# EAGLE schematic schematicEagle (EAGLE 9.6.2)
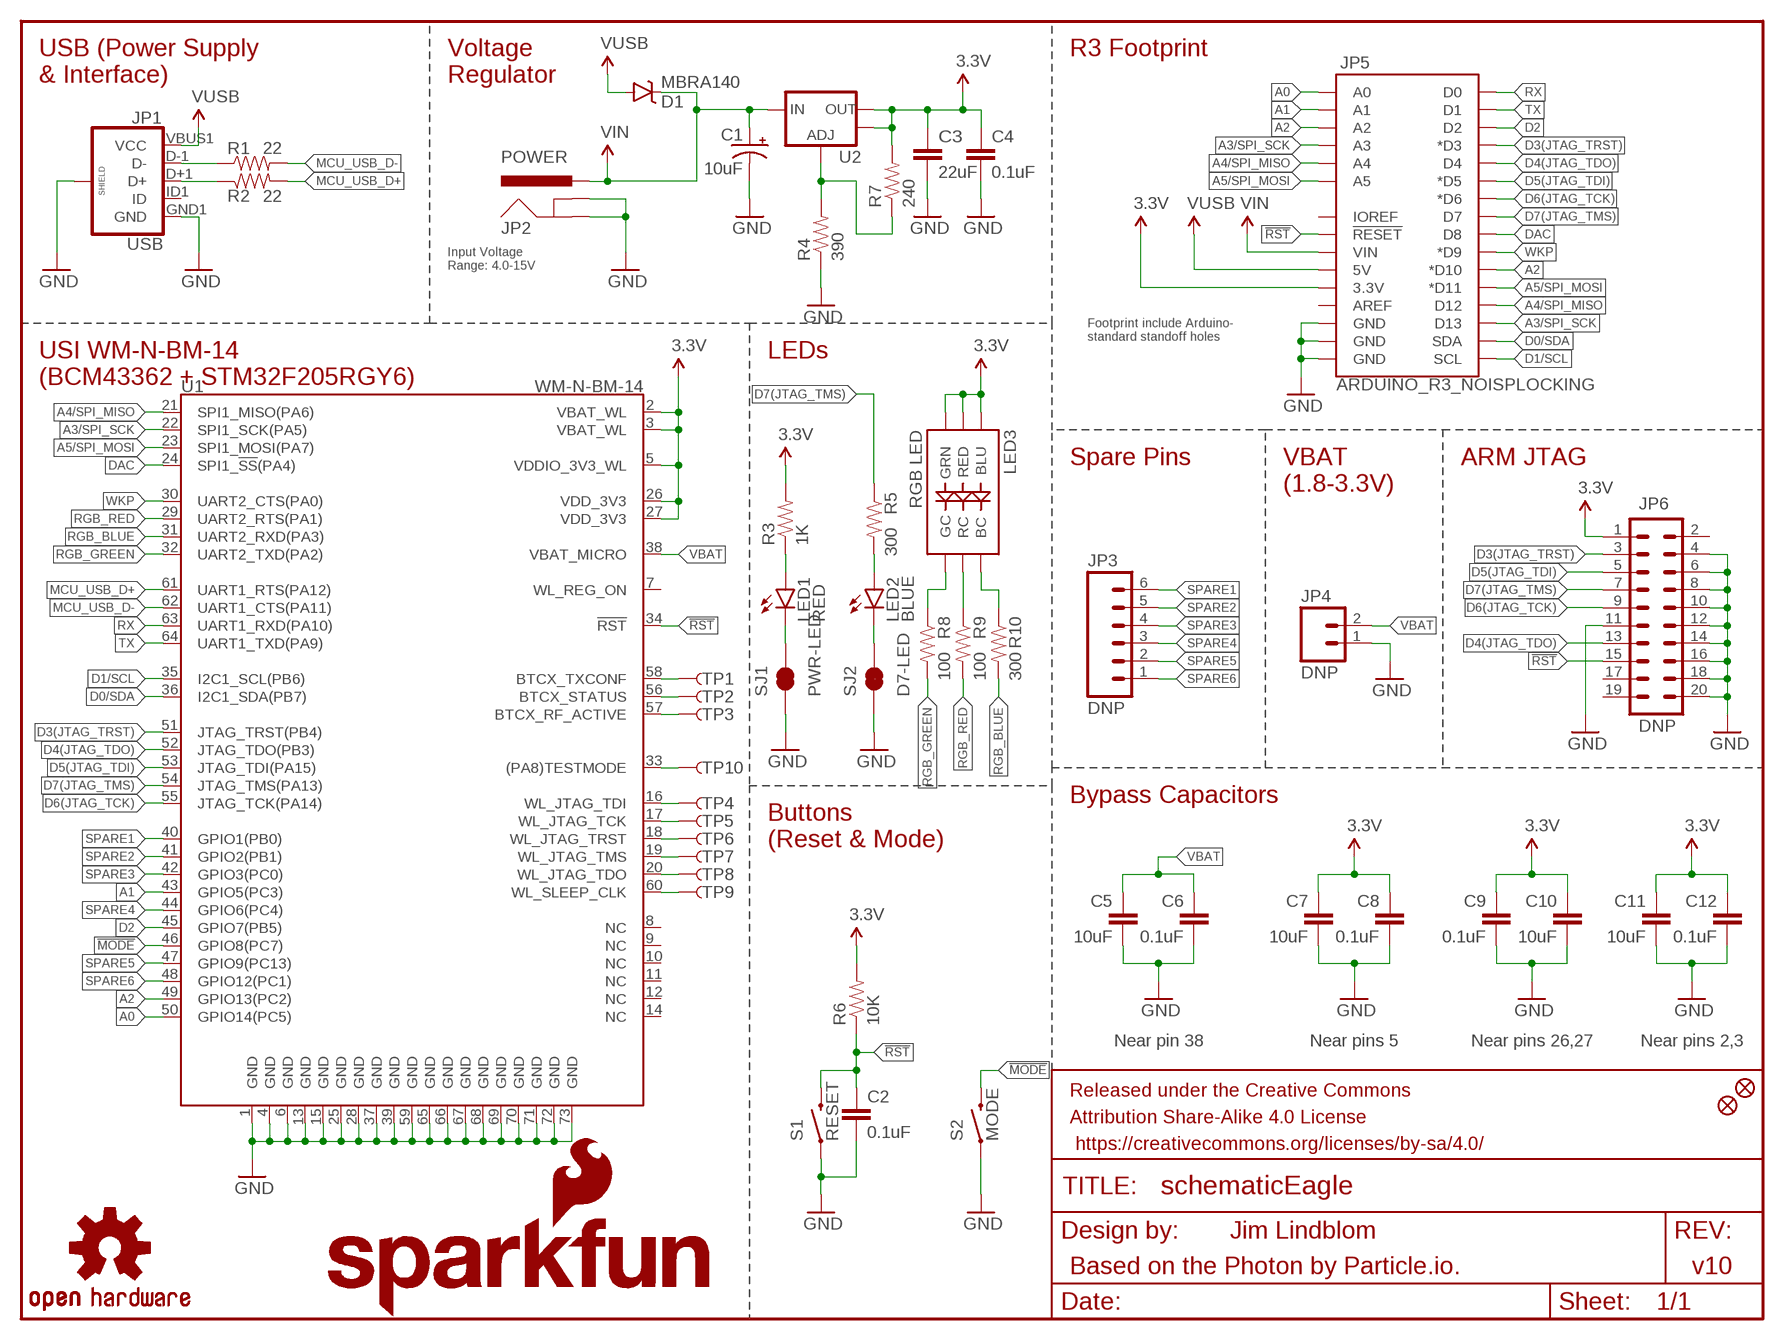
[diagram p0: schematic, sheet 1]

## Parts
C1  10uF  10UF-16V-10%(TANT)  [EIA3216]
C2  0.1uF  0.1UF-25V(+80/-20%)(0603)  [0603-CAP]
C3  22uF  22UF-6.3V-20%(0805)  [0805]
C4  0.1uF  0.1UF-25V(+80/-20%)(0603)  [0603-CAP]
C5  10uF  10UF-6.3V-20%(0603)  [0603-CAP]
C6  0.1uF  0.1UF-25V(+80/-20%)(0603)  [0603-CAP]
C7  10uF  10UF-6.3V-20%(0603)  [0603-CAP]
C8  0.1uF  0.1UF-25V(+80/-20%)(0603)  [0603-CAP]
C9  0.1uF  0.1UF-25V(+80/-20%)(0603)  [0603-CAP]
C10  10uF  10UF-6.3V-20%(0603)  [0603-CAP]
C11  10uF  10UF-6.3V-20%(0603)  [0603-CAP]
C12  0.1uF  0.1UF-25V(+80/-20%)(0603)  [0603-CAP]
D1  MBRA140  DIODE-SCHOTTKY-MBRA140  [SMA-DIODE]
FID1  FIDUCIAL1X2  [FIDUCIAL-1X2]
FID2  FIDUCIAL1X2  [FIDUCIAL-1X2]
FRAME1  FRAME-LETTER  [CREATIVE_COMMONS]
JP1  USB  USB_MICROB_PLUGCONN-11752  [USB-B-MICRO-SMD_V03]
JP2  POWER  POWER_JACKPTH_LOCK  [POWER_JACK_PTH_LOCK]
JP3  DNP  M06SILK_FEMALE_PTH  [1X06]
JP4  DNP  M02PTH  [1X02]
JP5  ARDUINO_R3_NOISPLOCKING  [ARDUINO_R3_NOISP_LOCKING]
JP6  DNP  M10X2  [2X10]
LED1  RED  LED-RED1206  [LED-1206]
LED2  BLUE  LED-BLUE1206  [LED-1206]
LED3  RGB LED  LED-TRICOLOR-NO-COMPLCC-6-SMD  [PLCC-6-LED]
LOGO1  OSHW-LOGOM  [OSHW-LOGO-M]
LOGO2  SFE_LOGO_NAME_FLAME.2_INCH  [SFE_LOGO_NAME_FLAME_.2]
LOGO3  SFE_LOGO_NAME_FLAME.4_INCH  [SFE_LOGO_NAME_FLAME_.4]
R1  22  22OHM1/10W1%(0603)  [0603-RES]
R2  22  22OHM1/10W1%(0603)  [0603-RES]
R3  1K  1KOHM-1/10W-1%(0603)  [0603-RES]
R4  390  390OHM1/10W1%(0603)  [0603-RES]
R5  300  300OHM-1/10W-1%(0603)  [0603-RES]
R6  10K  10KOHM-1/10W-1%(0603)0603  [0603-RES]
R7  240  240OHM1/10W1%(0603)  [0603-RES]
R8  100  100OHM-1/10W-1%(0603)  [0603-RES]
R9  100  100OHM-1/10W-1%(0603)  [0603-RES]
R10  300  300OHM-1/10W-1%(0603)  [0603-RES]
S1  RESET  SWITCH-MOMENTARY-2PTH  [TACTILE-PTH]
S2  MODE  SWITCH-MOMENTARY-2PTH  [TACTILE-PTH]
SJ1  PWR-LED  JUMPER-PAD-2-NC_BY_TRACE  [PAD-JUMPER-2-NC_BY_TRACE_YES_SILK]
SJ2  D7-LED  JUMPER-PAD-2-NC_BY_TRACE  [PAD-JUMPER-2-NC_BY_TRACE_YES_SILK]
TP1  TEST-POINTTP_15TH_THRU  [TP_15TH]
TP2  TEST-POINTTP_15TH_THRU  [TP_15TH]
TP3  TEST-POINTTP_15TH_THRU  [TP_15TH]
TP4  TEST-POINTTP_15TH_THRU  [TP_15TH]
TP5  TEST-POINTTP_15TH_THRU  [TP_15TH]
TP6  TEST-POINTTP_15TH_THRU  [TP_15TH]
TP7  TEST-POINTTP_15TH_THRU  [TP_15TH]
TP8  TEST-POINTTP_15TH_THRU  [TP_15TH]
TP9  TEST-POINTTP_15TH_THRU  [TP_15TH]
TP10  TEST-POINTTP_15TH_THRU  [TP_15TH]
U1  WM-N-BM-14  [WM-N-BM-14]
U2  V_REG_LM1117SOT223  [SOT223]

## Nets
3.3V: C3.1 C4.1 C7.1 C8.1 C9.1 C10.1 C11.1 C12.1 JP5.3.3V JP6.1 LED3.AB(BLU) LED3.AG(GRN) LED3.AR(RED) R3.2 R6.2 R7.2 U1.2(VBAT_WL) U1.3(VBAT_WL) U1.5(VDDIO_3V3_WL) U1.26(VDD_3V3) U1.27(VDD_3V3) U2.2(OUT) U2.4(OUT)
!MODE: S2.3 U1.46(GPIO8(PC7))
!RST: C2.1 JP5.RESET@1(!RESET!) JP6.15 R6.1 S1.3 U1.34(!RST!)
A0: JP5.A0 U1.50(GPIO14(PC5))
A1: JP5.A1 U1.43(GPIO5(PC3))
A2: JP5.A2 JP5.D10(*D10) U1.49(GPIO13(PC2))
A3/SPI_SCK: JP5.A3 JP5.D13 U1.22(SPI1_SCK(PA5))
A4/SPI_MISO: JP5.A4 JP5.D12 U1.21(SPI1_MISO(PA6))
A5/SPI_MOSI: JP5.A5 JP5.D11(*D11) U1.23(SPI1_MOSI(PA7))
BTCX_RF_ACTIVE: TP3.P$1 U1.57(BTCX_RF_ACTIVE)
BTCX_STATUS: TP2.P$1 U1.56(BTCX_STATUS)
BTCX_TXCONF: TP1.P$1 U1.58(BTCX_TXCONF)
D0/SDA: JP5.SDA U1.36(I2C1_SDA(PB7))
D1/SCL: JP5.SCL U1.35(I2C1_SCL(PB6))
D2: JP5.D2 U1.45(GPIO7(PB5))
D3(JTAG_TRST): JP5.D3(*D3) JP6.3 U1.51(JTAG_TRST(PB4))
D4(JTAG_TDO): JP5.D4 JP6.13 U1.52(JTAG_TDO(PB3))
D5(JTAG_TDI): JP5.D5(*D5) JP6.5 U1.53(JTAG_TDI(PA15))
D6(JTAG_TCK): JP5.D6(*D6) JP6.9 U1.55(JTAG_TCK(PA14))
D7(JTAG_TMS): JP5.D7 JP6.7 R5.1 U1.54(JTAG_TMS(PA13))
D+: JP1.D+1(D+) R2.1
D-: JP1.D-1(D-) R1.1
DAC: JP5.D8 U1.24(SPI1_!SS!(PA4))
GND: C1.C(-) C2.2 C3.2 C4.2 C5.2 C6.2 C7.2 C8.2 C9.2 C10.2 C11.2 C12.2 JP1.GND1(GND) JP1.SHIELD1(SHIELD) JP1.SHIELD2(SHIELD) JP1.SHIELD3(SHIELD) JP2.GND JP2.GNDBREAK JP4.1 JP5.GND@1(GND) JP5.GND@2(GND) JP5.GND@3(GND) JP6.4 JP6.6 JP6.8 JP6.10 JP6.11 JP6.12 JP6.14 JP6.16 JP6.18 JP6.20 R4.1 S1.1 S2.1 SJ1.1 SJ2.1 U1.1(GND) U1.4(GND) U1.6(GND) U1.13(GND) U1.15(GND) U1.25(GND) U1.28(GND) U1.37(GND) U1.39(GND) U1.59(GND) U1.65(GND) U1.66(GND) U1.67(GND) U1.68(GND) U1.69(GND) U1.70(GND) U1.71(GND) U1.72(GND) U1.73(GND)
MCU_USB_D+: R2.2 U1.61(UART1_RTS(PA12))
MCU_USB_D-: R1.2 U1.62(UART1_CTS(PA11))
N$1: TP10.P$1 U1.33((PA8)TESTMODE)
N$2: LED1.C SJ1.2
N$3: LED3.CG(GC) R8.1
N$4: LED3.CR(RC) R9.1
N$5: LED3.CB(BC) R10.1
N$6: LED1.A R3.1
N$7: LED2.A R5.2
N$8: LED2.C SJ2.2
N$15: R4.2 R7.1 U2.1(ADJ)
RGB_BLUE: R10.2 U1.31(UART2_RXD(PA3))
RGB_GREEN: R8.2 U1.32(UART2_TXD(PA2))
RGB_RED: R9.2 U1.29(UART2_RTS(PA1))
RX: JP5.D0 U1.63(UART1_RXD(PA10))
SPARE1: JP3.6 U1.40(GPIO1(PB0))
SPARE2: JP3.5 U1.41(GPIO2(PB1))
SPARE3: JP3.4 U1.42(GPIO3(PC0))
SPARE4: JP3.3 U1.44(GPIO6(PC4))
SPARE5: JP3.2 U1.47(GPIO9(PC13))
SPARE6: JP3.1 U1.48(GPIO12(PC1))
TX: JP5.D1 U1.64(UART1_TXD(PA9))
VBAT: C5.1 C6.1 JP4.2 U1.38(VBAT_MICRO)
VIN: C1.A(+) D1.C JP2.PWR JP5.VIN U2.3(IN)
VUSB: D1.A JP1.VBUS1(VCC) JP5.5V
WKP: JP5.D9(*D9) U1.30(UART2_CTS(PA0))
WL_JTAG_TCK: TP5.P$1 U1.17(WL_JTAG_TCK)
WL_JTAG_TDI: TP4.P$1 U1.16(WL_JTAG_TDI)
WL_JTAG_TDO: TP8.P$1 U1.20(WL_JTAG_TDO)
WL_JTAG_TMS: TP7.P$1 U1.19(WL_JTAG_TMS)
WL_JTAG_TRST: TP6.P$1 U1.18(WL_JTAG_TRST)
WL_SLEEP_CLK: TP9.P$1 U1.60(WL_SLEEP_CLK)
Unconnected: JP1.ID1(ID) JP5.AREF JP5.IOREF JP6.2 JP6.17 JP6.19 U1.7(WL_REG_ON) U1.8(NC) U1.9(NC) U1.10(NC) U1.11(NC) U1.12(NC) U1.14(NC)

## Notes on the sheet
- USB (Power Supply
  & Interface)
- Voltage
  Regulator
- R3 Footprint
- Input Voltage
  Range: 4.0-15V
- USI WM-N-BM-14
  (BCM43362 + STM32F205RGY6)
- LEDs
- Footprint include Arduino-
  standard standoff holes
- Spare Pins
- VBAT
  (1.8-3.3V)
- ARM JTAG
- Bypass Capacitors
- Buttons
  (Reset & Mode)
- Near pin 38 | Near pins 5 | Near pins 26,27 | Near pins 2,3
- Jim Lindblom
- Based on the Photon by Particle.io. | v10

## Library data of the parts
C1 = SparkFun-Capacitors:10UF-16V-10%(TANT): CAP-00811 1206/EIA-3216 Tantalum capacitor; PROD_ID: CAP-00811
C2 C4 C6 C8 C9 C12 = SparkFun-Capacitors:0.1UF-25V(+80/-20%)(0603): CAP-00810 Ceramic Standard decoupling cap; PROD_ID: CAP-00810
C3 = SparkFun-Capacitors:22UF-6.3V-20%(0805): CAP-08402 Ceramic; PROD_ID: CAP-08402
C5 C7 C10 C11 = SparkFun-Capacitors:10UF-6.3V-20%(0603): CAP-11015; PROD_ID: CAP-11015
D1 = SparkFun-DiscreteSemi:DIODE-SCHOTTKY: Schottky diodes in SFE's production catalog BAT20J 1A 23V 0.62Vf RB751 120mA 40V 0.37Vf PMEG4005EJ 0.5A 40V 0.42Vf MBRA140 1A 40V 0.5Vf B340A 3A 40V SMA; PROD_ID: DIO-08053
FID1 FID2 = SparkFun-Aesthetics:FIDUCIAL: Fiducial Alignment Points Various fiducial points for machine vision alignment.
FRAME1 = SparkFun-Aesthetics:FRAME-LETTER: Schematic Frame Standard 8.5x11 US Letter frame; DESIGNER: Jim Lindblom; VERSION: v01
JP1 = SparkFun-Connectors:USB_MICROB_PLUG: USB Micro-B connectors Some male, some female. Watch your step!; PROD_ID: CONN-11752
JP2 = SparkFun-Connectors:POWER_JACK: Power Jack This is the standard 5.5mm barrel jack for power. The PTH is the most common, proven, reliable, footprint. The Slot footprint only works if the mill layer is transmitted to the PCB fab house so be warned. Mating wall wart : TOL-00298 (and others); PROD_ID: CONN-08197; SF_ID: PRT-00119
JP3 = SparkFun-Connectors:M06: Header 6 Standard 6-pin 0.1" header. Use with straight break away headers (SKU : PRT-00116), right angle break away headers (PRT-00553), swiss pins (PRT-00743), machine pins (PRT-00117), and female headers (PRT-00115). Molex polarized connector foot print use with SKU : PRT-08094 with associated crimp pins and housings. NOTES ON THE VARIANTS LOCK and LOCK_LONGPADS... This footprint was designed to help hold the alignment of a through-hole component (i.e. 6-pin header) while soldering it into place. You may notice that each hole has been shifted either up or down by 0.005 of an inch from it's more standard position (which is a perfectly straight line). This slight alteration caused the pins (the squares in the middle) to touch the edges of the holes. Because they are alternating, it causes a "brace" to hold the component in place. 0.005 has proven to be the perfect amount of "off-center" position when using our standard breakaway headers. Although looks a little odd when you look at the bare footprint, once you have a header in there, the alteration is very hard to notice. Also,if you push a header all the way into place, it is covered up entirely on the bottom side. This idea of altering the position of holes to aid alignment will be further integrated into the Sparkfun Library for other footprints. It can help hold any component with 3 or more connection pins.; PROD_ID: CONN-08437
JP4 = SparkFun-Connectors:M02: Standard 2-pin 0.1" header. Use with - straight break away headers ( PRT-00116) - right angle break away headers (PRT-00553) - swiss pins (PRT-00743) - machine pins (PRT-00117) - female headers (PRT-00115) Molex polarized connector foot print use with: PRT-08233 with associated crimp pins and housings. 2.54_SCREWTERM for use with PRT-10571. 3.5mm Screw Terminal footprints for PRT-08084 5mm Screw Terminal footprints for use with PRT-08432
JP5 = sparkfun_photon_temp:ARDUINO_R3_NOISP
JP6 = SparkFun-Connectors:M10X2: This was SPECIALLY designed to be used with our Graphic LCD Backpack. Be sure you want to use this! It is not only staggered on each line of header holes, but IT IS ALSO offset of the center point of the top and bottom lines by 5 mil. This causes the headers to lock into place on the "standard" footprint on the LCD screen. The extra squares on the tdocu layer are there simply to reference other pins (if you were to actually populate a longer header than ten long - this is what we do with the backpacks).
LED1 = SparkFun-LED:LED-RED: Assorted Red LEDs LilyPad 1206- DIO-09912 1206- DIO-00809 0603- DIO-00819; PROD_ID: DIO-00809
LED2 = SparkFun-LED:LED-BLUE: Blue LEDs for production use Various blue LEDs stocked by SparkFun production 0603 - DIO-08575 Rebel - DIO-09553 1206 - DIO-09911; PROD_ID: DIO-09911
LED3 = SparkFun-LED:LED-TRICOLOR-NO-COM; PROD_ID: DIO-12113
LOGO1 = SparkFun-Aesthetics:OSHW-LOGO: Open Source Hardware Logo This logo indicates the piece of hardware it is found on incorporates a OSHW license and/or adheres to the definition of open source hardware found here: http://freedomdefined.org/OSHW
LOGO2 LOGO3 = SparkFun-Aesthetics:SFE_LOGO_NAME_FLAME: SFE Logo, name and flame This is the SparkFun full logo. The logo on the schematic will always be the same size; the package variant is the height of the flame part of the logo. Default layer for the logo on the board is tSilk.
R1 R2 = SparkFun-Resistors:22OHM1/10W1%(0603): RES-08698; PROD_ID: RES-08698
R3 = SparkFun-Resistors:1KOHM-1/10W-1%(0603): RES-07856; PROD_ID: RES-07856
R4 = SparkFun-Resistors:390OHM1/10W1%(0603): RES-07864; PROD_ID: RES-07864
R5 R10 = SparkFun-Resistors:300OHM-1/10W-1%(0603): RES-10328; PROD_ID: RES_10328
R6 = SparkFun-Resistors:10KOHM-1/10W-1%(0603): RES-00824; PROD_ID: RES-00824
R7 = SparkFun-Resistors:240OHM1/10W1%(0603): RES-07849; PROD_ID: RES-07849
R8 R9 = SparkFun-Resistors:100OHM-1/10W-1%(0603): RES-07863; PROD_ID: RES-07863
S1 S2 = SparkFun-Electromechanical:SWITCH-MOMENTARY-2: Various NO switches- pushbuttons, reed, etc; PROD_ID: SWCH-08441
SJ1 SJ2 = SparkFun-Passives:JUMPER-PAD-2-NC_BY_TRACE
TP1-TP10 = SparkFun-Passives:TEST-POINT: Bare copper test points for troubleshooting or ICT
U1 = sparkfun_photon_temp:WM-N-BM-14; PROD_ID: IC-12589
U2 = SparkFun-PowerIC:V_REG_LM1117: Voltage Regulator LM1117 Standard adjustable voltage regulator but in SMD form. Spark Fun Electronics SKU : COM-00595; PROD_ID: VREG-08170

## Net classes
0 default: width 0.203 mm